# Altium schematic sheet StepperMotorController.SchDoc
size A; SheetNumber: 1; SheetTotal: 1
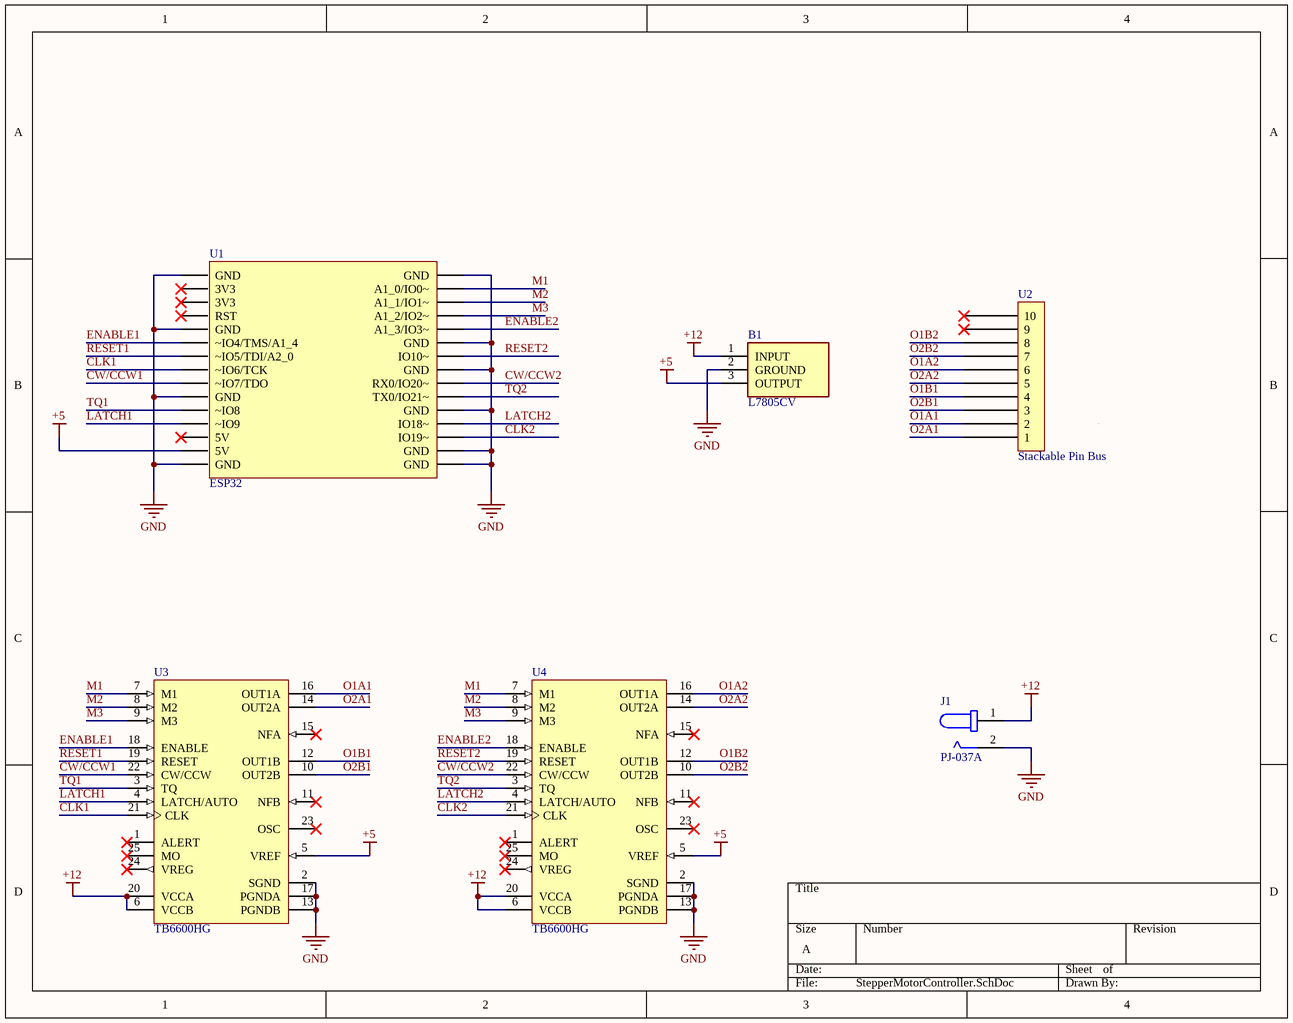
[diagram p0: StepperMotorController.SchDoc]

## Parts
B1  L7805CV  [TO255P460X1020X2008-3P]
J1  PJ-037A  [CUI_PJ-037A]
U1  ESP32  [ESP32]
U2  Stackable Pin Bus  [STACKABLE_PIN_BUS]
U3  TB6600HG  [TOSH-HZIP25-1.00F-25]
U4  TB6600HG  [TOSH-HZIP25-1.00F-25]

## Nets
+5: B1.3(OUTPUT) U1.14(5V) U3.5(VREF) U4.5(VREF)
+12: B1.1(INPUT) J1.1 U3.6(VCCB) U3.20(VCCA) U4.6(VCCB) U4.20(VCCA)
GND: B1.2(GROUND) J1.2 U1.1(GND) U1.5(GND) U1.10(GND) U1.15(GND) U1.16(GND) U1.17(GND) U1.20(GND) U1.23(GND) U1.25(GND) U1.30(GND) U3.2(SGND) U3.13(PGNDB) U3.17(PGNDA) U4.2(SGND) U4.13(PGNDB) U4.17(PGNDA)
CLK1: U1.8(~IO6/TCK) U3.21(CLK)
CLK2: U1.18(IO19~) U4.21(CLK)
CW/CCW1: U1.9(~IO7/TDO) U3.22(CW/CCW)
CW/CCW2: U1.22(RX0/IO20~) U4.22(CW/CCW)
ENABLE1: U1.6(~IO4/TMS/A1_4) U3.18(ENABLE)
ENABLE2: U1.26(A1_3/IO3~) U4.18(ENABLE)
LATCH1: U1.12(~IO9) U3.4(LATCH/AUTO)
LATCH2: U1.19(IO18~) U4.4(LATCH/AUTO)
M1: U1.29(A1_0/IO0~) U3.7(M1) U4.7(M1)
M2: U1.28(A1_1/IO1~) U3.8(M2) U4.8(M2)
M3: U1.27(A1_2/IO2~) U3.9(M3) U4.9(M3)
O1A1: U2.2 U3.16(OUT1A)
O1A2: U2.6 U4.16(OUT1A)
O1B1: U2.4 U3.12(OUT1B)
O1B2: U2.8 U4.12(OUT1B)
O2A1: U2.1 U3.14(OUT2A)
O2A2: U2.5 U4.14(OUT2A)
O2B1: U2.3 U3.10(OUT2B)
O2B2: U2.7 U4.10(OUT2B)
RESET1: U1.7(~IO5/TDI/A2_0) U3.19(RESET)
RESET2: U1.24(IO10~) U4.19(RESET)
TQ1: U1.11(~IO8) U3.3(TQ)
TQ2: U1.21(TX0/IO21~) U4.3(TQ)

Not connected (* = marked no-connect by the designer): U1 2(3V3)* 3(3V3)* 4(RST)* 13(5V)*; U2 9* 10*; U3 1(ALERT)* 11(NFB)* 15(NFA)* 23(OSC)* 24(VREG)* 25(MO)*; U4 1(ALERT)* 11(NFB)* 15(NFA)* 23(OSC)* 24(VREG)* 25(MO)*

## Library data of the parts
B1 = L7805CV: Linear voltage regulator,L7805CV 5V 1.5A STMicroelectronics L7805CV, Single Linear Voltage Regulator, 1.5A 5 V, 3-Pin TO-220; Geometry.Height: 4.6mm; Mouser Part Number: 511-L7805CV; Mouser Price/Stock: https://www.mouser.co.uk/ProductDetail/STMicroelectronics/L7805CV?qs=9NrABl3fj%2FqplZAHiYUxWg%3D%3D; Manufacturer_Name: STMicroelectronics; Manufacturer_Part_Number: L7805CV; Datasheet Link: http://www.st.com/web/en/resource/technical/document/datasheet/CD00000444.pdf
J1 = PJ-037A: 2.0 mm Center Pin, 2.5 A, Right Angle, Through Hole, Dc Power Jack Connector; Package: None; MP: PJ-037A; Value: *; Availability: Unavailable; Price: None
U1 = ESP32-C3-DEVKITC-02: Manufacturer: Espressif Systems; Supplier: Digikey; Supplier Part Number: 1965-ESP32-C3-DEVKITC-02-ND; Manufacturer Part Number: ESP32-C3-DEVKITC-02; RoHS: No; Category: RF Semiconductors and Devices; Stock: 1074; Pricing: 1=8 (USD)
U2 = Barramento Empilhável: 10 pinos, Passo 2.54mm, Dimensões da barra 26x2x8mm
U3 = CMP-0695-00001-1: PWM Chopper-Type Bipolar Stepping Motor Driver IC, 5.5 V Input Voltage, 4.5 A Output Current, -30 to 85 degC, 25-Pin FM (HZIP25-1.00F); Manufacturer: Toshiba; OSC Frequency: 2.0 to 6.0 MHz; VIN (Typ.): 5.5 V; Power Supply Voltage (Max.): 45 V; Clock Frequency (Max.): 200 KHz; Output Current (Typ.): 4.5 A; DatasheetVersion: Oct-13; ComponentLink2Description: Datasheet; ComponentLink1Description: Manufacturer URL; ComponentLink1URL: http://www.toshiba-components.com/; PackageDescription: 25-Pin HZIP25-P-1.00F, Body 4.5 x 29.3 mm, Pitch 1 mm; PartNumber: TB6600HG; Operating Temperature: -30 to 85 degC; ComponentLink2URL: http://www.toshiba-components.com/docs/linear/TB6600HG_en_datasheet.pdf; Mounting Technology: Through Hole; PackageReference: HZIP25-P-1.00F-25
U4 = TB550HD: PWM Chopper-Type Bipolar Stepping Motor Driver IC, 5.5 V Input Voltage, 4.5 A Output Current, -30 to 85 degC, 25-Pin FM (HZIP25-1.00F); Manufacturer: Toshiba; OSC Frequency: 2.0 to 6.0 MHz; VIN (Typ.): 5.5 V; Power Supply Voltage (Max.): 45 V; Clock Frequency (Max.): 200 KHz; Output Current (Typ.): 4.5 A; DatasheetVersion: Oct-13; ComponentLink2Description: Datasheet; ComponentLink1Description: Manufacturer URL; ComponentLink1URL: http://www.toshiba-components.com/; PackageDescription: 25-Pin HZIP25-P-1.00F, Body 4.5 x 29.3 mm, Pitch 1 mm; PartNumber: TB6600HG; Operating Temperature: -30 to 85 degC; ComponentLink2URL: http://www.toshiba-components.com/docs/linear/TB6600HG_en_datasheet.pdf; Mounting Technology: Through Hole; PackageReference: HZIP25-P-1.00F-25